# Altium schematic sheet PushButton.SchDoc: Push Button
size A4; Author: Sanju Prakash Kannioth; DrawnBy: Sanju Prakash Kannioth; Engineer: Sanju Prakash Kannioth; Revision: 1.0; SheetNumber: 10; SheetTotal: 10
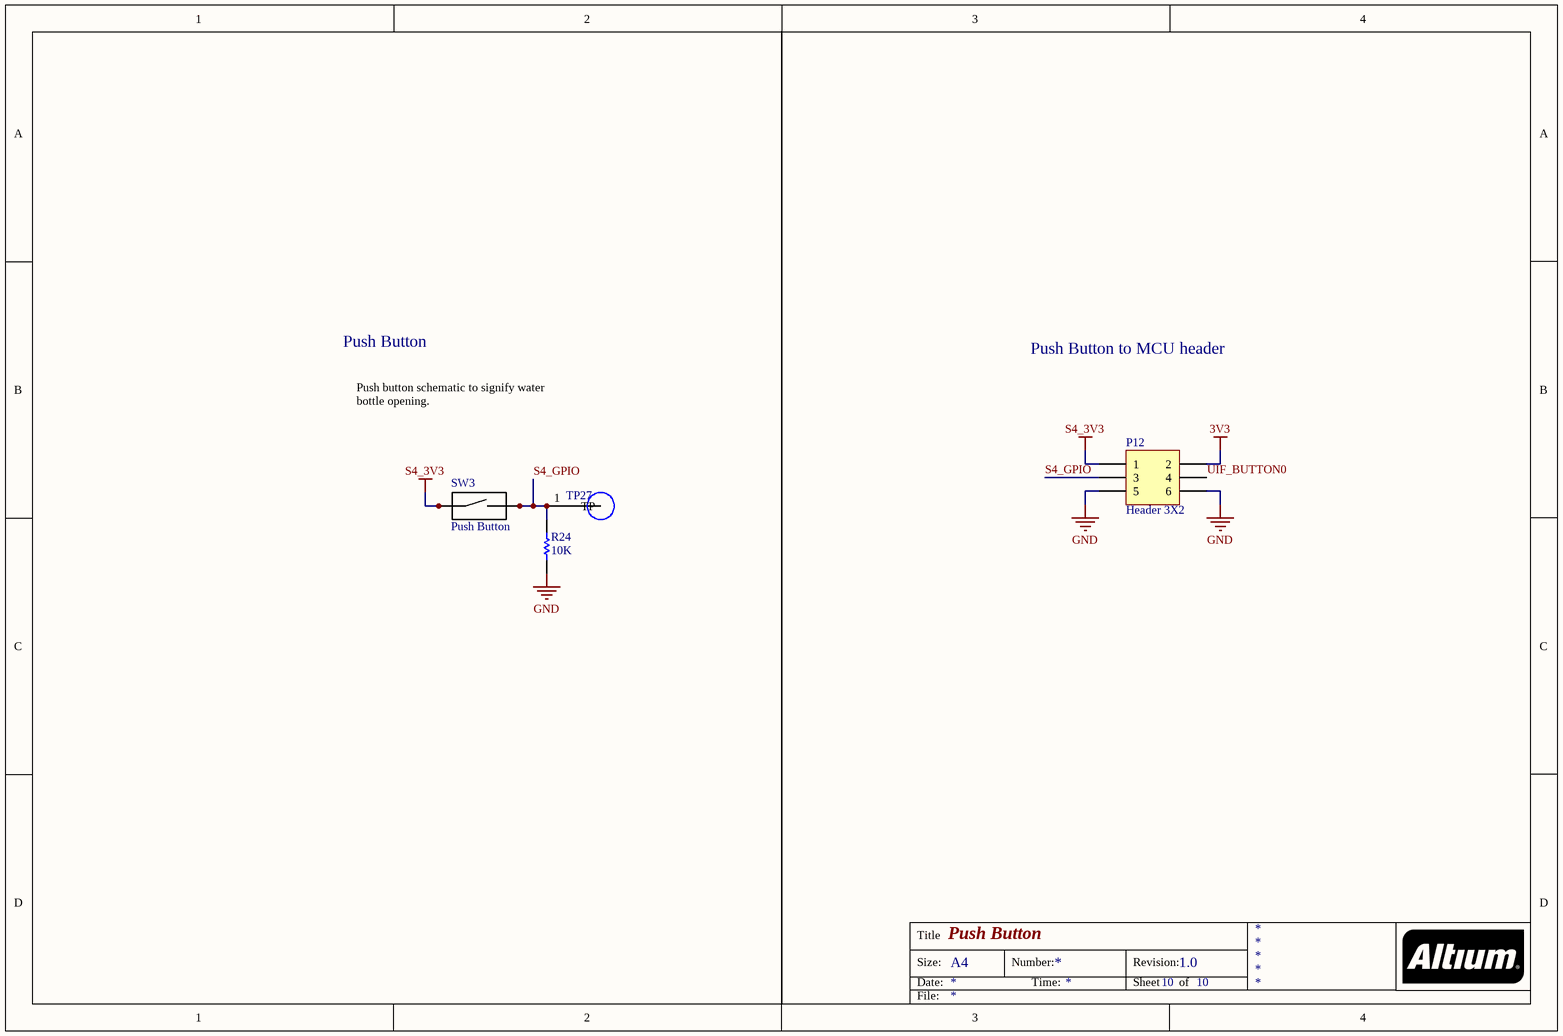
[diagram p0: PushButton.SchDoc]

## Parts
P12  Header 3X2  [HDR2X3]
R24  value 10K  [1608[0603]]  (hidden comment: Res1)
SW3  Push Button  [Push Button]
TP27  TP  [TP]  (value not drawn)

## Nets
3V3: P12.2
GND: P12.5 P12.6 R24.1
S4_3V3: P12.1 SW3.3 SW3.4
S4_GPIO: P12.3 R24.2 SW3.1 SW3.2 TP27.1(TP)
UIF_BUTTON0: P12.4

## Notes on the sheet
- Push Button
- Push Button to MCU header
- Push button schematic to signify water bottle opening.
- Title
- Size:
- Date:
- A4
- Number:
- Time:
- Revision:
- Sheet
- of
- File:

## Library data of the parts
P12 = Header 3X2: Header, 3-Pin, Dual row; Manufacturer: Amphenol ICC (FCI); Manufacturer Part Number: 67997-212HLF; DigiKeyURL: https://www.digikey.com/product-detail/en/amphenol-icc-fci/67997-212HLF/609-3237-ND/1878564; Digi-Key Part Number: 609-3237-ND
R24 = Res1: RES 10K OHM 1% 1/8W 0603; Manufacturer: Stackpole Electronics Inc; Manufacturer Part Number: RNCP0603FTD10K0; Digi-Key Part Number: RNCP0603FTD10K0CT-ND; DigiKeyURL: https://www.digikey.com/product-detail/en/stackpole-electronics-inc/RNCP0603FTD10K0/RNCP0603FTD10K0CT-ND/2240478
SW3 = Push Button: SWITCH TACTILE SPST-NO 0.05A 24V; Manufacturer: TE Connectivity ALCOSWITCH Switches; Manufacturer Part Number: FSM6JSMATR; Digi-Key Part Number: 450-2058-1-ND; DigiKeyURL: https://www.digikey.com/products/en?keywords=450-2058-1-ND
TP27 = TP: PC TEST POINT MINIATURE; Manufacturer: Keystone Electronics; Manufacturer Part Number: 5019; Snapeda_Url: https://www.snapeda.com/parts/5019/Keystone%20Electronics/view-part/?ref=search&t=5019; DigiKeyURL: https://www.digikey.com/product-detail/en/keystone-electronics/5019/36-5019CT-ND/3907344?utm_source=snapeda&utm_medium=aggregator&utm_campaign=symbol; Digi-Key Part Number: 36-5019CT-ND